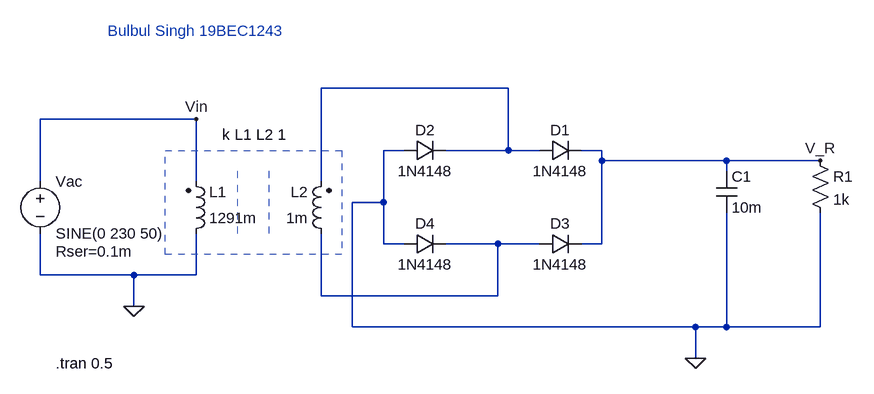
[diagram p0: schematic fullwave32(1).asc]
fullwave32(1).asc, the LTspice schematic file:
Version 4
SHEET 1 1360 680
WIRE 816 -32 528 -32
WIRE 336 16 96 16
WIRE 656 64 624 64
WIRE 816 64 816 -32
WIRE 816 64 720 64
WIRE 864 64 816 64
WIRE 960 64 928 64
WIRE 960 80 960 64
WIRE 1152 80 960 80
WIRE 1296 80 1152 80
WIRE 1152 96 1152 80
WIRE 96 112 96 16
WIRE 336 112 336 16
WIRE 528 112 528 -32
WIRE 624 144 624 64
WIRE 624 144 576 144
WIRE 624 208 624 144
WIRE 656 208 624 208
WIRE 800 208 720 208
WIRE 864 208 800 208
WIRE 960 208 960 80
WIRE 960 208 928 208
WIRE 96 256 96 192
WIRE 240 256 96 256
WIRE 336 256 336 192
WIRE 336 256 240 256
WIRE 528 288 528 192
WIRE 800 288 800 208
WIRE 800 288 528 288
WIRE 240 304 240 256
WIRE 576 336 576 144
WIRE 1104 336 576 336
WIRE 1152 336 1152 160
WIRE 1152 336 1104 336
WIRE 1296 336 1296 160
WIRE 1296 336 1152 336
WIRE 1104 384 1104 336
FLAG 1104 384 0
FLAG 240 304 0
FLAG 1296 80 V_R
FLAG 336 16 Vin
SYMBOL voltage 96 96 R0
WINDOW 123 0 0 Left 0
WINDOW 39 24 124 Left 2
SYMATTR SpiceLine Rser=0.1m
SYMATTR InstName Vac
SYMATTR Value SINE(0 230 50)
SYMBOL diode 864 80 R270
WINDOW 0 32 32 VTop 2
WINDOW 3 0 32 VBottom 2
SYMATTR InstName D1
SYMATTR Value 1N4148
SYMBOL diode 656 80 R270
WINDOW 0 32 32 VTop 2
WINDOW 3 0 32 VBottom 2
SYMATTR InstName D2
SYMATTR Value 1N4148
SYMBOL diode 864 224 R270
WINDOW 0 32 32 VTop 2
WINDOW 3 0 32 VBottom 2
SYMATTR InstName D3
SYMATTR Value 1N4148
SYMBOL diode 656 224 R270
WINDOW 0 32 32 VTop 2
WINDOW 3 0 32 VBottom 2
SYMATTR InstName D4
SYMATTR Value 1N4148
SYMBOL cap 1136 96 R0
SYMATTR InstName C1
SYMATTR Value 10m
SYMBOL res 1280 64 R0
SYMATTR InstName R1
SYMATTR Value 1k
SYMBOL ind2 320 208 M180
WINDOW 0 36 80 Left 2
WINDOW 3 36 40 Left 2
SYMATTR InstName L1
SYMATTR Value 1291m
SYMATTR Type ind
SYMBOL ind2 544 208 R180
WINDOW 0 36 80 Left 2
WINDOW 3 36 40 Left 2
SYMATTR InstName L2
SYMATTR Value 1m
SYMATTR Type ind
TEXT 376 40 Left 2 !k L1 L2 1
TEXT 120 392 Left 2 !.tran 0.5
TEXT 200 -120 Left 2 ;Bulbul Singh 19BEC1243
LINE Normal 400 192 400 96 2
LINE Normal 448 192 448 96 2
RECTANGLE Normal 560 224 288 64 2

The netlist it stands for:
* fullwave32(1).asc
Vac Vin 0 SINE(0 230 50) Rser=0.1m
D1 N001 V_R 1N4148
D2 0 N001 1N4148
D3 N002 V_R 1N4148
D4 0 N002 1N4148
C1 V_R 0 10m
R1 V_R 0 1k
L1 0 Vin 1291m
L2 N002 N001 1m
.model D D
.lib standard.dio
k L1 L2 1
.tran 0.5
* Bulbul Singh 19BEC1243
.backanno
.end